# Altium project Qunyin_mmWave_core.PrjPcb (part 2 of 2)

## Sheet Qunyin_mmWave_flash&USB.SchDoc: mmWave_iwr6843aop
size 457 x 292 mm; DrawnBy: Wxd; Organization: Shanghai Qunyin; Address1: Xianxia Rd 601; Address2: Changning district; Address3: Shanghai; DocumentNumber: 4; SheetNumber: 4; SheetTotal: 6
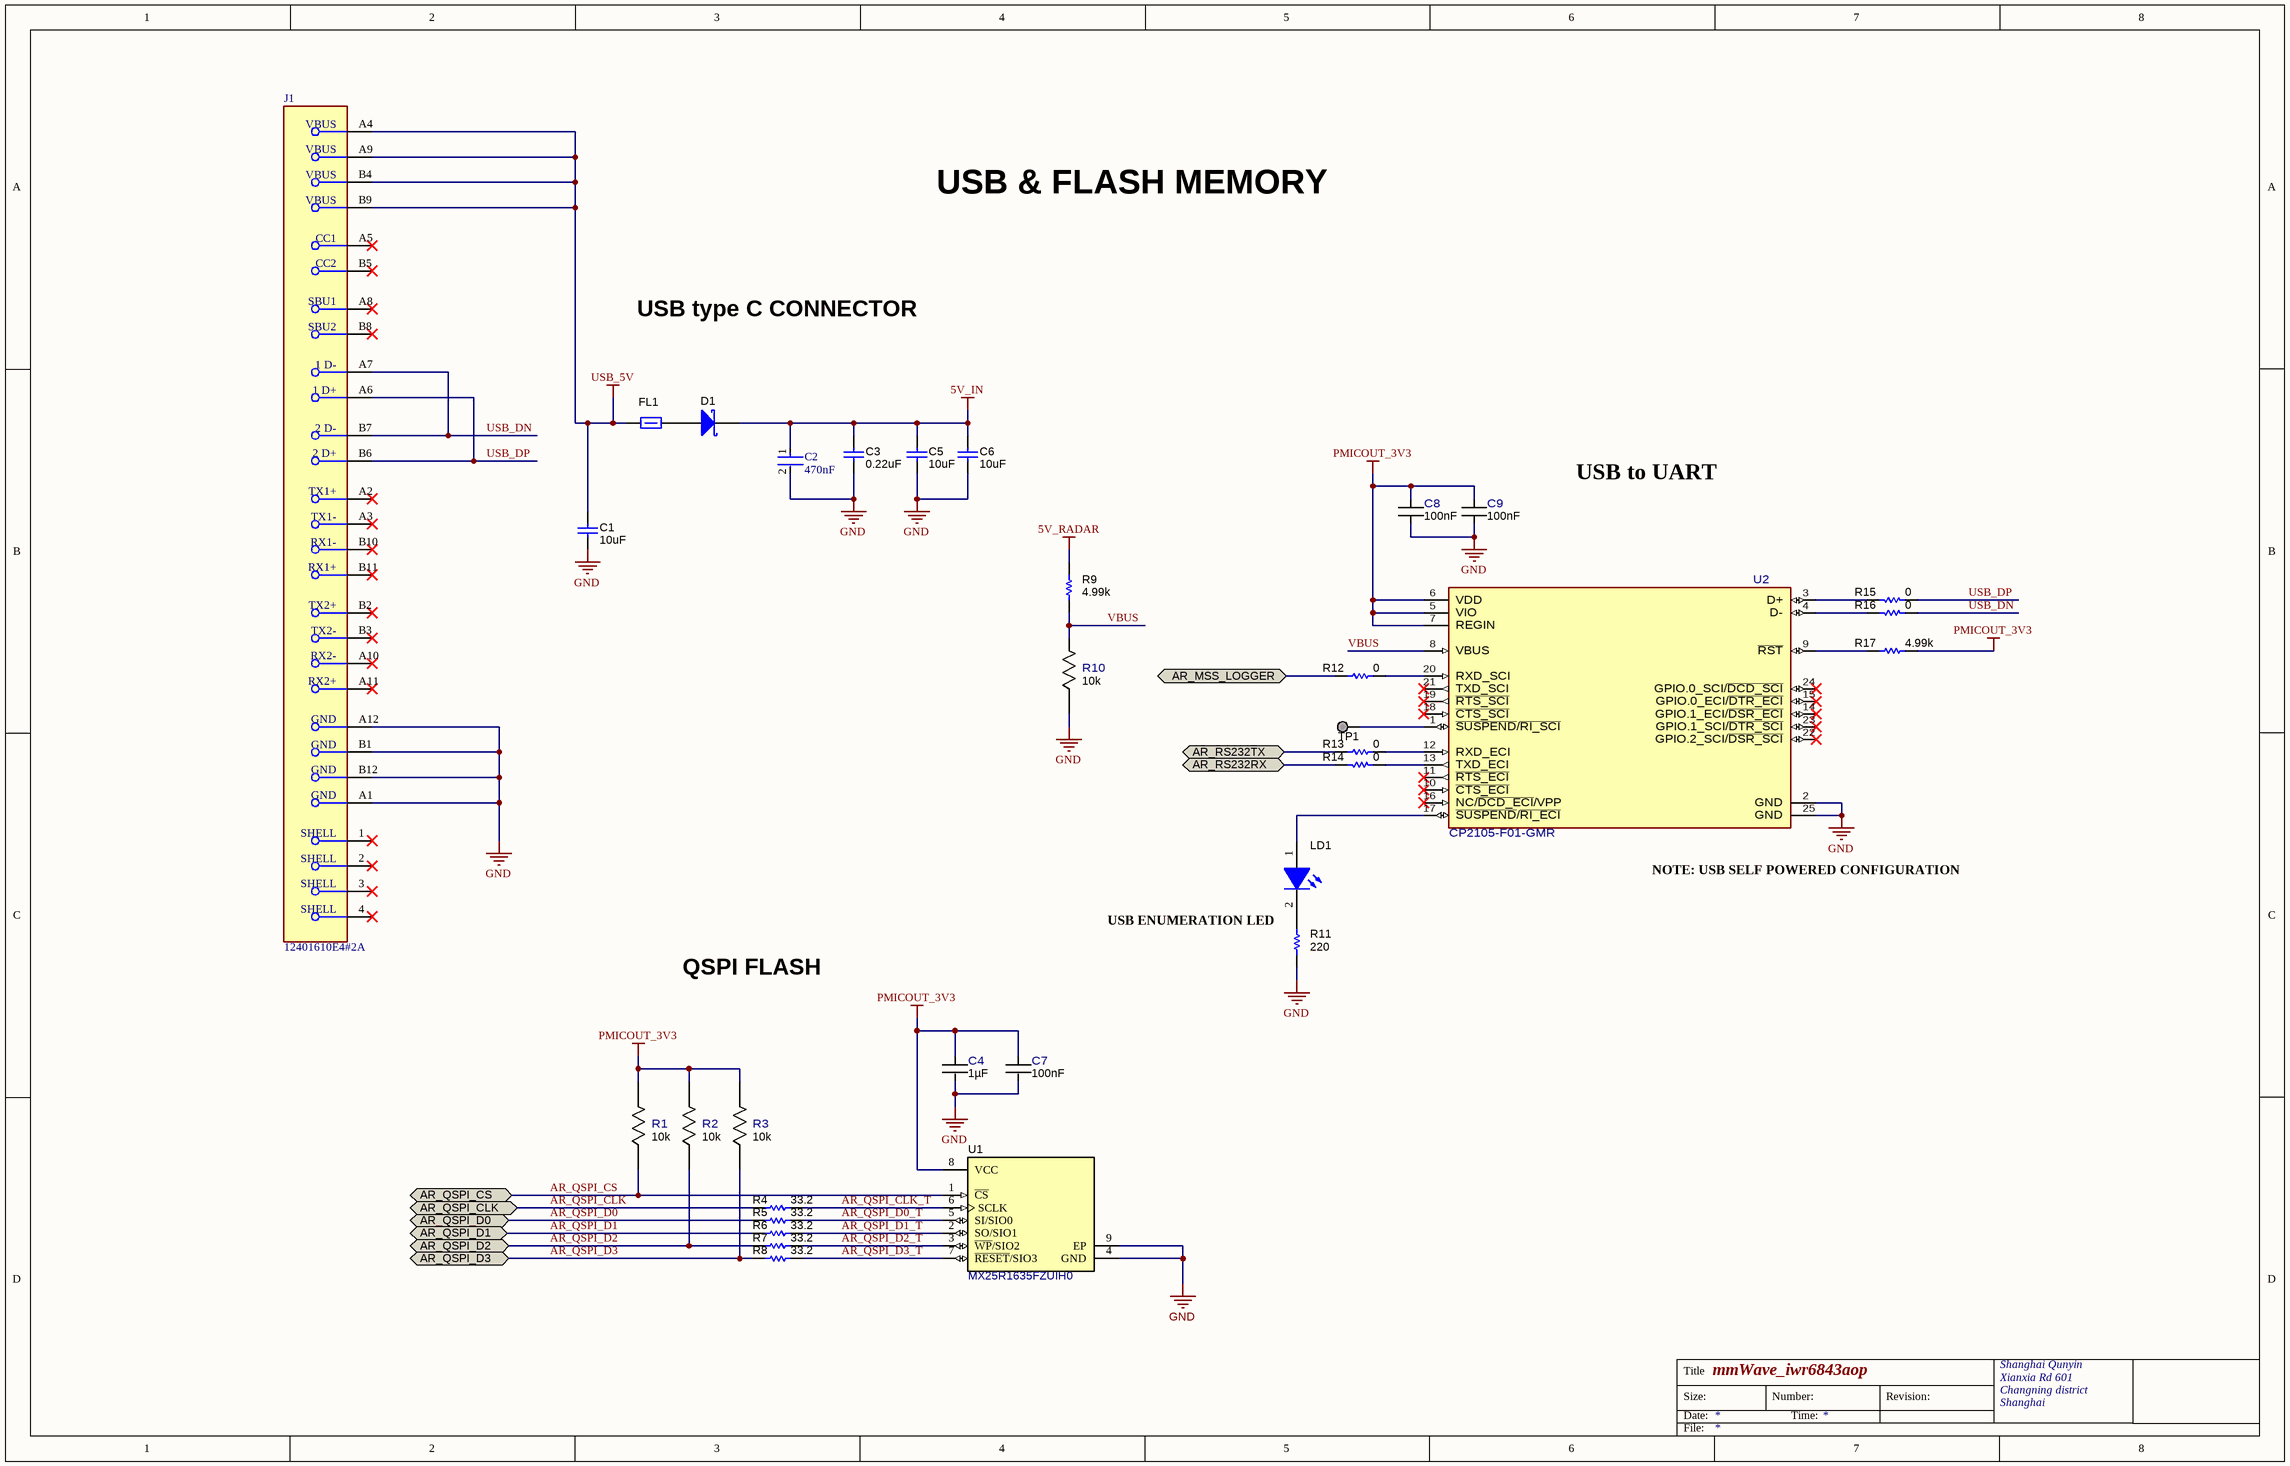
[diagram p3: Qunyin_mmWave_flash&USB.SchDoc]

### Parts
C1  value 10uF  [0402_070]  (hidden comment: CL05A106MP5NUNC)
C2  Capacitance: 470nF  [FP-C1005-050-0_05-IPC_B]  (hidden comment: C1005X5R1E474K050BB)
C3  value 0.22uF  [0201_033L]  (hidden comment: LMK063BJ224MP-F)
C4  Cap_F: 1µF  [FP-CL03A105MO3NRNH_0201-IPC_C]  (hidden comment: CL03A105MO3NRNH)
C5  value 10uF  [0402_070]  (hidden comment: CL05A106MP5NUNC)
C6  value 10uF  [0402_070]  (hidden comment: CL05A106MP5NUNC)
C7  Cap_F: 100nF  [FP-GRM033R6YA104KE14D_0201 (0603 Metric)-IPC_C]  (hidden comment: GRM033R6YA104KE14D)
C8  Cap_F: 100nF  [FP-GRM033R6YA104KE14D_0201 (0603 Metric)-IPC_C]  (hidden comment: GRM033R6YA104KE14D)
C9  Cap_F: 100nF  [FP-GRM033R6YA104KE14D_0201 (0603 Metric)-IPC_C]  (hidden comment: GRM033R6YA104KE14D)
D1  NSR20F30NXT5G  [DSN2_0603]  (value not drawn)
FL1  BLM15PD300SZ1D  [0402L]  (value not drawn)
J1  12401610E4#2A  [FP-12401610E4#2A-MFG]
LD1  APHHS1005CGCK  [APHHS1005_Green]  (value not drawn)
R1  Res_ohm: 10k  [FP-RR0306P-103-D_0201-IPC_C]  (hidden comment: RR0306P-103-D)
R2  Res_ohm: 10k  [FP-RR0306P-103-D_0201-IPC_C]  (hidden comment: RR0306P-103-D)
R3  Res_ohm: 10k  [FP-RR0306P-103-D_0201-IPC_C]  (hidden comment: RR0306P-103-D)
R4  value 33.2  [0201L]  (hidden comment: CRCW020133R2FNED)
R5  value 33.2  [0201L]  (hidden comment: CRCW020133R2FNED)
R6  value 33.2  [0201L]  (hidden comment: CRCW020133R2FNED)
R7  value 33.2  [0201L]  (hidden comment: CRCW020133R2FNED)
R8  value 33.2  [0201L]  (hidden comment: CRCW020133R2FNED)
R9  value 4.99k  [0201L]  (hidden comment: RC0201FR-074K99L)
R10  Res_ohm: 10k  [FP-RR0306P-103-D_0201-IPC_C]  (hidden comment: RR0306P-103-D)
R11  value 220  [0201L]  (hidden comment: RC0201JR-07220RL)
R12  Res_ohm: 0  [FP-RC0201JR-070RL_0201 (0603 Metric)-MFG]  (hidden comment: RC0201JR-070RL)
R13  Res_ohm: 0  [FP-RC0201JR-070RL_0201 (0603 Metric)-MFG]  (hidden comment: RC0201JR-070RL)
R14  Res_ohm: 0  [FP-RC0201JR-070RL_0201 (0603 Metric)-MFG]  (hidden comment: RC0201JR-070RL)
R15  Res_ohm: 0  [FP-RC0201JR-070RL_0201 (0603 Metric)-MFG]  (hidden comment: RC0201JR-070RL)
R16  Res_ohm: 0  [FP-RC0201JR-070RL_0201 (0603 Metric)-MFG]  (hidden comment: RC0201JR-070RL)
R17  value 4.99k  [0201L]  (hidden comment: RC0201FR-074K99L)
TP1  TESTPOINT  [TP_25MIL-SMT]  (value not drawn)  (no BOM)
U1  MX25R1635FZUIH0  [USON-8L]
U2  CP2105-F01-GMR  [FP-CP2105-F01-GMR_QFN24-EP-IPC_A]

### Ports
AR_MSS_LOGGER (bidir), AR_QSPI_CLK (bidir), AR_QSPI_CS (bidir), AR_QSPI_D0 (bidir), AR_QSPI_D1 (bidir), AR_QSPI_D2 (bidir), AR_QSPI_D3 (bidir), AR_RS232RX (bidir), AR_RS232TX (bidir)

### Nets
5V_IN: C2.1 C3.1 C5.2 C6.1 D1.1(K)
5V_RADAR: R9.1
GND: C1.1 C2.2 C3.2 C4.2 C5.1 C6.2 C7.2 C8.1 C9.1 J1.A1(GND) J1.A12(GND) J1.B1(GND) J1.B12(GND) R10.1 R11.1 U1.4(GND) U1.9(EP) U2.2(GND) U2.25(GND)  [project net AGND]
PMICOUT_3V3: C4.1 C7.1 C8.2 C9.2 R1.2 R2.2 R3.2 R17.1 U1.8(VCC) U2.5(VIO) U2.6(VDD) U2.7(REGIN)
USB_5V: C1.2 FL1.1 J1.A4(VBUS) J1.A9(VBUS) J1.B4(VBUS) J1.B9(VBUS)
AR_MSS_LOGGER: R12.2 ; port AR_MSS_LOGGER
AR_QSPI_CLK: R4.1 ; port AR_QSPI_CLK
AR_QSPI_CLK_T: R4.2 U1.6(SCLK)
AR_QSPI_CS: R1.1 U1.1(~{CS}) ; port AR_QSPI_CS
AR_QSPI_D0: R5.1 ; port AR_QSPI_D0
AR_QSPI_D0_T: R5.2 U1.5(SI/SIO0)
AR_QSPI_D1: R6.1 ; port AR_QSPI_D1
AR_QSPI_D1_T: R6.2 U1.2(SO/SIO1)
AR_QSPI_D2: R2.1 R7.1 ; port AR_QSPI_D2
AR_QSPI_D2_T: R7.2 U1.3(~{WP}/SIO2)
AR_QSPI_D3: R3.1 R8.1 ; port AR_QSPI_D3
AR_QSPI_D3_T: R8.2 U1.7(~{RESET}/SIO3)
AR_RS232RX: R14.1 ; port AR_RS232RX
AR_RS232TX: R13.2 ; port AR_RS232TX
USB_DN: J1.A7(1_D-) J1.B7(2_D-) R16.2
USB_DP: J1.A6(1_D+) J1.B6(2_D+) R15.2
VBUS: R9.2 R10.2 U2.8(VBUS)
NetD1_2: D1.2(A) FL1.2
NetLD1_1: LD1.1(A) U2.17(~{SUSPEND}/~{RI_ECI})
NetLD1_2: LD1.2(K) R11.2
NetR12_1: R12.1 U2.20(RXD_SCI)
NetR13_1: R13.1 U2.12(RXD_ECI)
NetR14_2: R14.2 U2.13(TXD_ECI)
NetR15_1: R15.1 U2.3(D+)
NetR16_1: R16.1 U2.4(D-)
NetR17_2: R17.2 U2.9(~{RST})
NetTP1_1: TP1.1 U2.1(~{SUSPEND}/~{RI_SCI})

Not connected (* = marked no-connect by the designer): J1 1(SHELL)* 2(SHELL)* 3(SHELL)* 4(SHELL)* A2(TX1+)* A3(TX1-)* A5(CC1)* A8(SBU1)* A10(RX2-)* A11(RX2+)* B2(TX2+)* B3(TX2-)* B5(CC2)* B8(SBU2)* B10(RX1-)* B11(RX1+)*; U2 10(~{CTS_ECI})* 11(~{RTS_ECI})* 14(GPIO.1_ECI/~{DSR_ECI})* 15(GPIO.0_ECI/~{DTR_ECI})* 16(NC/~{DCD_ECI}/VPP)* 18(~{CTS_SCI})* 19(~{RTS_SCI})* 21(TXD_SCI)* 22(GPIO.2_SCI/~{DSR_SCI})* 23(GPIO.1_SCI/~{DTR_SCI})* 24(GPIO.0_SCI/~{DCD_SCI})*

### Notes on the sheet
- USB & FLASH MEMORY
- USB type C CONNECTOR
- USB to UART
- (near U2) NOTE: USB SELF POWERED CONFIGURATION
- QSPI FLASH
- USB ENUMERATION LED
- Title
- Size:
- Date:
- Number:
- Time:
- Revision:
- File:

### Library data of the parts
C1 C5 C6 = CMP-0006339-4: CAP, CERM, 10 uF, 10 V, +/- 20%, X5R, 0402; Manufacturer: Samsung Electro-Mechanics; AEC Category: Q200; AEC Qualified: N; Cap_Case: 0402; Cap_F: 10µF; SizeArea_mm2: 0.5; SizeAreaWB_mm2: 3; SizeX_mm: 1; SizeZ_mm: 0.6; TaMax_C: 85°C; TaMin_C: -55°C; U/M: EA; Value1: Unknown; Value2: 10V; RoHS: Y; AEC Grade: N/A; ComponentLink1Description: Datasheet link; ComponentLink1URL: http://www.samsungsem.com/kr/support/product-search/mlcc/__icsFiles/afieldfile/2018/06/21/CL05A106MP5NUNC.pdf; CompType: Capacitor; MountType: SMT; PackageReference: 0402; PartNumber: CL05A106MP5NUNC; Polarized: N; SizeY_mm: 0.5; Technology: Ceramic; TempCo: X5R; Tolerance_%: 20%; ValueDisplayed: 10uF; VDC_V: 10V
C2 = CMP-2000-06003-2: Multilayer Ceramic Capacitors 470nF ±10% 25V X5R SMD 0402; Dissipation Factor: 10%; Case Code (Metric): 1005; RoHS Compliant: Yes; Lead Free: Lead Free; Length: 1mm; Case/Package: 0402; Termination: SMD/SMT; Voltage Rating: 25V; Dielectric Material: Ceramic; Dielectric: X5R; Depth: 0.5mm; Series: C; Voltage: 25V; Tolerance: 10%; Packaging: Tape and Reel; Resistor Type: Ceramic; Min Operating Temperature: -55°C; Width: 0.02inch; Thickness: 500um; Package Quantity: 10000; Case Code (Imperial): 0402; Construction: Flat; Height: 0.5mm; REACH SVHC: No SVHC; Radiation Hardening: No; Weight: 2.3E-05oz; Mount: Surface Mount; Voltage Rating (DC): 25V; Max Operating Temperature: 85°C
C3 = CMP-0009781-1: CAP, CERM, 0.22 uF, 10 V, +/- 20%, X5R, 0201; Manufacturer: Taiyo Yuden; AEC Category: Q200; AEC Qualified: N; Cap_Case: 0201; Cap_F: 220nF; SizeArea_mm2: 0.18; SizeAreaWB_mm2: 2.08; SizeX_mm: 0.6; SizeY_mm: 0.3; SizeZ_mm: 0.33; TaMax_C: 85°C; TaMin_C: -55°C; U/M: EA; Value1: Unknown; Value2: 10V; RoHS: Y; AEC Grade: N/A; ComponentLink1Description: Datasheet link; ComponentLink1URL: http://www.yuden.co.jp/productdata/catalog/en/mlcc_all_e.pdf; CompType: Capacitor; LatestRevisionDate: 2017-03-09; MountType: SMT; PackageReference: 0201; PartNumber: LMK063BJ224MP-F; Polarized: N; Published: 2008-06-19; Publisher: Texas Instruments; Supplier 1: Digi-Key; Supplier 2: Newark; Supplier 3: Mouser; Supplier Part Number 1: 587-2483-1-ND; Supplier Part Number 2: 48T3327; Supplier Part Number 3: 963-LMK063BJ224MP-F; Technology: Ceramic; TempCo: X5R; Tolerance_%: 20%; ValueDisplayed: 0.22uF; VDC_V: 10V
C4 = CMP-0086446-1: 1µF ±20% 16V Ceramic Capacitor X5R 0201; Manufacturer: Samsung Electro-Mechanics; AEC Qualified: No; SizeZ_mm: 0.39mm; Symbol Name: SYM-CL03A105MO3NRNH; TempCo: 15%; RoHS: TRUE; ComponentLink1Description: Datasheet; ComponentLink1URL: http://www.samsungsem.com/global/front/downloadcms.do?path=%2F%2Fglobal%2F%2Fsupport%2F%2Fproduct-search%2F%2Fmlcc%2F%2F__icsFiles%2F%2Fafieldfile%2F%2F2018%2F%2F06%2F%2F21&fileName=CL03A105MO3NRNH.pdf; PackageReference: 0201; PartNumber: CL03A105MO3NRNH; Tolerance_%: 20%; VDC_V: 16V
C7-C9 = CMP-0086440-1: Cap Ceramic 0.1uF 35V X5R 10% Pad SMD 0201 85C T/R; Manufacturer: Murata Electronics North America; AEC Qualified: No; SizeZ_mm: 0.33mm; Symbol Name: SYM-GRM033R6YA104KE14D; TempCo: 15%; RoHS: TRUE; ComponentLink1Description: Datasheet; ComponentLink1URL: https://search.murata.co.jp/Ceramy/image/img/A01X/G101/ENG/GRM033R6YA104KE14-01.pdf; PackageReference: 0201 (0603 Metric); PartNumber: GRM033R6YA104KE14D; Tolerance_%: 10%; VDC_V: 35V
D1 = CMP-0028829-2: Diode, Schottky, 30 V, 2 A, 2-XFDFN; Manufacturer: ON Semiconductor; Value2: 0.48V; SizeY_mm: 0.8; Value: 30V; TJmax_C: 150°C; Green_Lifecycle: Not Set; SizeAreaWB_mm2: 4.68; Value1: 2A; SizeArea_mm2: 1.28; Green_REACh: Incomplete; AEC Category: Q101; SizeZ_mm: 0.31; Vf_V: 480mV; AEC Qualified: N; SizeX_mm: 1.6; Green_EU RoHS: Incomplete; PackageReference: 2-XFDFN; RoHS: Y; PartNumber: NSR20F30NXT5G; ComponentLink1Description: Datasheet link; Vr_V: 30V; MountType: SMT; Type: Schottky; CompType: Diode; Green_EU RoHS-2: Incomplete; ComponentLink1URL: http://www.onsemi.com/pub_link/Collateral/NSR20F30-D.PDF; Io_A: 2A
FL1 = CMP-0078934-1: Inductor, Ferrite Bead, Ferrite, 2.2 A, 0.035 ohm, AEC-Q200 Grade 1, SMD; Manufacturer: MuRata; AEC Category: Q200; AEC Grade: 1; AEC Qualified: Y; DCR_ohm: 0.035; Imax_A: 2.2A; SizeArea_mm2: 0.5; SizeAreaWB_mm2: 3; SizeZ_mm: 0.6; RoHS: Y; ComponentLink1Description: Datasheet link; ComponentLink1URL: https://www.murata.com/en-us/products/productdata/8796748677150/QNFA9118.pdf; CompType: Inductor; LatestRevisionDate: 2017-12-07; Material: Ferrite; MountType: SMT; PackageReference: 0402; PartNumber: BLM15PD300SZ1D; Published: 2008-06-26; Publisher: Texas Instruments; SizeX_mm: 1; SizeY_mm: 0.5; Supplier 1: Digi-Key; Supplier 2: Mouser; Supplier Part Number 1: 490-16506-1-ND; Supplier Part Number 2: 81-BLM15PD300SZ1D; Technology: Ferrite Bead; Value1: 0.035 ohm; Value2: 2.2A
J1 = CMP-02355-000003-1: CONN RCP USB3.1 TYPEC 24P SMD RA; Connector Type: USB; Number of Contacts: 24; Gender: Receptacle; Packaging: Cut Tape; Mount: Surface Mount; Number of Pins: 24
LD1 = CMP-0067682-2: LED, Green, SMD; Manufacturer: Kingbright; Angle: 120.0; Power_TotalModule: 75mW; SizeZ_mm: 0.6; Vf_V: 2.1V; Vr_V: 5V; Io_A: 20mA; Ir_A: 10µA; SizeArea_mm2: 0.5; SizeAreaWB_mm2: 3.0; SizeX_mm: 1.0; Tjmax_C: 85°C; Value1: 0.075W; RoHS: Y; Color: Green; ComponentLink1Description: Datasheet link; ComponentLink1URL: http://www.kingbrightusa.com/images/catalog/SPEC/APHHS1005CGCK.pdf; PackageReference: 0402; PartNumber: APHHS1005CGCK; CompType: LED; MountType: SMT; SizeY_mm: 0.5; Type: ?; Value2: 2.1V; Value: Green
R1-R3 R10 = CMP-0088002-1: 10 kOhms ±0.5% 0.05W, 1/20W Chip Resistor 0201 (0603 Metric)  Thin Film; Manufacturer: Susumu; AEC Qualified: No; Power_W: 50mW; SizeZ_mm: 0.26mm; Symbol Name: SYM-RR0306P-103-D; TempCo: 25ppm/°C; VDC_V: 15V; RoHS: TRUE; ComponentLink1Description: Datasheet; ComponentLink1URL: https://www.susumu.co.jp/common/pdf/n_catalog_partition05_en.pdf; PackageReference: 0201; PartNumber: RR0306P-103-D; Technology: Thin Film; Tolerance_%: 0.5%
R4-R8 = CMP-0027275-3: RES, 33.2, 1%, 0.05 W, 0201; Manufacturer: Vishay-Dale; AEC Category: Q200; AEC Qualified: N; EIA_Code: E96; Power_W: 50mW; SizeArea_mm2: 0.18; SizeX_mm: 0.6; SizeY_mm: 0.3; SizeZ_mm: 0.26; TempCo: 200 ppm/C; Value2: 0.05W; Value_Code: 33R2; RoHS: E; AEC Grade: N/A; ComponentLink1Description: Datasheet link; ComponentLink1URL: http://www.vishay.com/docs/20052/crcw0201e3.pdf; CompType: Resistor; MountType: SMT; PackageReference: 0201; PartNumber: CRCW020133R2FNED; Res_ohm: 33.2; Supplier 1: Digi-Key; Supplier 2: Newark; Supplier 3: Mouser; Supplier Part Number 1: 541-33.2ABCT-ND; Supplier Part Number 2: 26W8649; Supplier Part Number 3: 71-CRCW020133R2FNED; Technology: Thick Film; Tolerance_%: 1%; Value1: 1%; ValueDisplayed: 33.2
R9 R17 = CMP-0027745-1: RES, 4.99 k, 1%, 0.05 W, 0201; Manufacturer: Yageo America; AEC Category: Q200; AEC Qualified: N; EIA_Code: E96; Power_W: 50mW; SizeArea_mm2: 0.18; SizeX_mm: 0.6; SizeY_mm: 0.3; SizeZ_mm: 0.26; TempCo: 200 ppm/C; U/M: EA; Value2: 0.05W; Value_Code: 4k99; VDC_V: 25V; RoHS: Y; AEC Grade: N/A; ComponentLink1Description: Datasheet link; ComponentLink1URL: http://www.yageo.com/documents/recent/PYu-RC_Group_51_RoHS_L_5.pdf; CompType: Resistor; LatestRevisionDate: 2017-03-09; MountType: SMT; PackageReference: 0201; PartNumber: RC0201FR-074K99L; Published: 2016-10-14; Publisher: Texas Instruments; Res_ohm: 4.99k; Supplier 1: Digi-Key; Supplier 2: Mouser; Supplier Part Number 1: YAG2712CT-ND; Supplier Part Number 2: 603-RC0201FR-074K99L; Technology: Thick Film; Tolerance_%: 1%; Value1: 1%; ValueDisplayed: 4.99k
R11 = CMP-0027072-1: RES, 220, 5%, 0.05 W, 0201; Manufacturer: Yageo America; AEC Category: Q200; AEC Qualified: N; EIA_Code: E24; Power_W: 50mW; SizeArea_mm2: 0.18; SizeX_mm: 0.6; SizeY_mm: 0.3; SizeZ_mm: 0.26; TempCo: 200 ppm/C; U/M: EA; Value2: 0.05W; Value_Code: 220R; VDC_V: 25V; RoHS: Y; AEC Grade: N/A; ComponentLink1Description: Datasheet link; ComponentLink1URL: http://www.yageo.com/documents/recent/PYu-RC_Group_51_RoHS_L_5.pdf; CompType: Resistor; LatestRevisionDate: 2017-03-09; MountType: SMT; PackageReference: 0201; PartNumber: RC0201JR-07220RL; Published: 2016-10-14; Publisher: Texas Instruments; Res_ohm: 220; Supplier 1: Digi-Key; Supplier 2: Mouser; Supplier Part Number 1: 311-220NCT-ND; Supplier Part Number 2: 603-RC0201JR-07220RL; Technology: Thick Film; Tolerance_%: 5%; Value1: 5%; ValueDisplayed: 220
R12-R16 = CMP-0086442-2: RES SMD 0 OHM JUMPER 1/20W 0201; Manufacturer: Yageo; AEC Qualified: No; Power_W: 50mW; SizeZ_mm: 0.26mm; TempCo: 200ppm/°C; Tolerance_%: 5%; VDC_V: 25V; RoHS: TRUE; ComponentLink1Description: Datasheet; ComponentLink1URL: http://www.yageo.com/documents/recent/PYu-RC_Group_51_RoHS_L_10.pdf; PackageReference: 0201 (0603 Metric); PartNumber: RC0201JR-070RL; Technology: Thick Film
TP1 = CMP-0078143-3: TEST POINT.  No entry in BOM.; CompType: Testpoint; Manufacturer: N/A; PackageReference: N/A; PartNumber: N/A; Library Reference: TESTPOINT
U1 = CMP-0078466-1: ULTRA LOW POWER, 16M-BIT [x 1/x 2/x 4] CMOS MXSMIO (SERIAL MULTI I/O) FLASH MEMORY, SON-8; Manufacturer: Macronix International Co., LTD; SizeArea_mm2: 6; SizeAreaWB_mm2: 12; SizeX_mm: 3; SizeY_mm: 2; SizeZ_mm: 0.6; RoHS: Y; ComponentLink1Description: Datasheet URL; ComponentLink1URL: http://www.macronix.com/Lists/Datasheet/Attachments/6257/MX25R1635F,%20Wide%20Range,%2016Mb,%20v1.5.pdf; MountType: SMT; PackageReference: SON-8; PartNumber: MX25R1635FZUIH0; Supplier 1: Digi-Key; Supplier Part Number 1: 1092-1178-1-ND
U2 = CMP-0087172-1: I/O Controller Interface IC USB to Dual UART bridge; Manufacturer: Silicon Labs; SizeZ_mm: 0.8mm; RoHS: TRUE; ComponentLink1Description: Datasheet; ComponentLink1URL: https://www.silabs.com/documents/public/data-sheets/CP2105.pdf; PackageReference: QFN24-EP; PartNumber: CP2105-F01-GMR; Symbol Name: SYM-CP2105-F01-GMR

## Sheet Qunyin_mmWave_ESP32.SchDoc: mmWave_iwr6843aop
size 457 x 292 mm; DrawnBy: Wxd; Organization: Shanghai Qunyin; Address1: Xianxia Rd 601; Address2: Changning district; Address3: Shanghai; DocumentNumber: 5; SheetNumber: 5; SheetTotal: 6
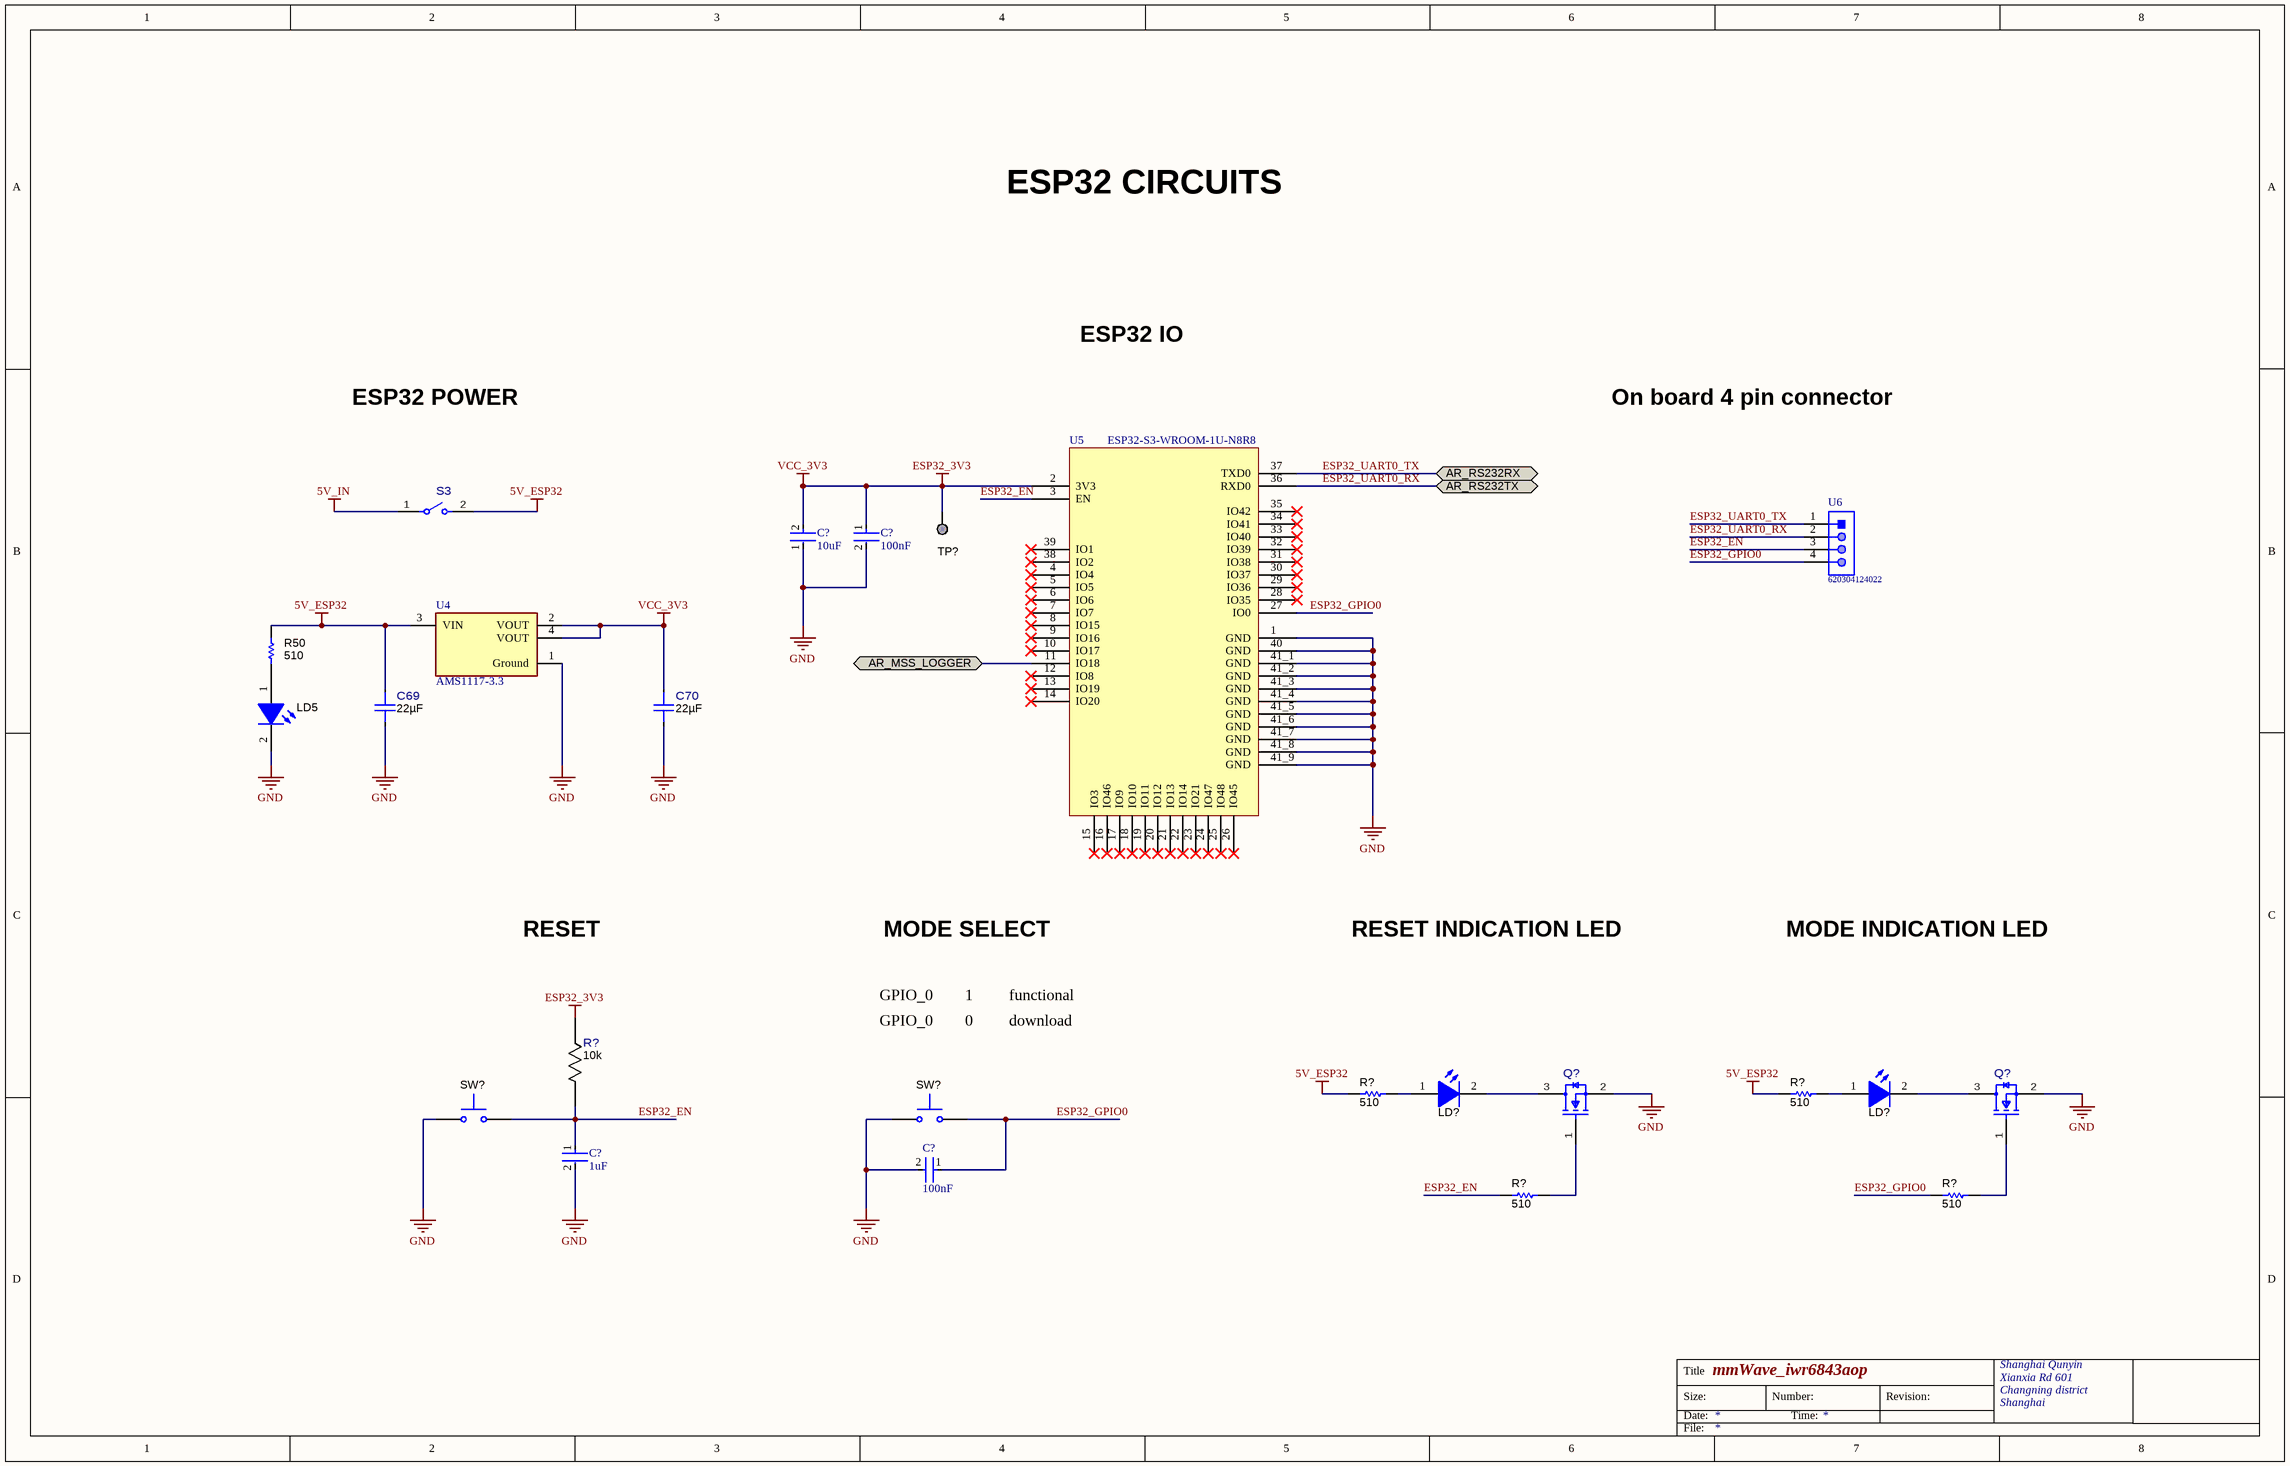
[diagram p4: Qunyin_mmWave_ESP32.SchDoc]

### Parts
(Parts that share a designator on the sheet are numbered #1, #2 ... from top to bottom, then left to right.)
C69  Cap_F: 22µF  [FP-CL05A226MQ5N6J8_0402-IPC_C]  (hidden comment: CL05A226MQ5N6J8)
C70  Cap_F: 22µF  [FP-CL05A226MQ5N6J8_0402-IPC_C]  (hidden comment: CL05A226MQ5N6J8)
C?#1  Capacitance: 10uF  [FP-C1608-080-0_1-MFG]  (hidden comment: C1608X5R1A106K080AC)
C?#2  Capacitance: 100nF  [FP-C1005-050-0_05-IPC_C]  (hidden comment: C1005X7R1H104K050BB)
C?#3  Capacitance: 1uF  [FP-0603-L_1_6_0_1-W_0_8_0-IPC_A]  (hidden comment: TMK107B7105KA-T)
C?#4  Capacitance: 100nF  [FP-C1005-050-0_05-IPC_C]  (hidden comment: C1005X7R1H104K050BB)
LD5  APHHS1005CGCK  [APHHS1005_Green]  (value not drawn)
LD?#1  APHHS1005CGCK  [APHHS1005_Green]  (value not drawn)
LD?#2  APHHS1005CGCK  [APHHS1005_Green]  (value not drawn)
Q?#1  BSS123-7-F  [FP-BSS123-7-F_SOT23-IPC_C]  (value not drawn)
Q?#2  BSS123-7-F  [FP-BSS123-7-F_SOT23-IPC_C]  (value not drawn)
R50  value 510  [0201L]  (hidden comment: RC0201JR-07510RL)
R?#1  Res_ohm: 10k  [FP-RR0306P-103-D_0201-IPC_C]  (hidden comment: RR0306P-103-D)
R?#2  value 510  [0201L]  (hidden comment: RC0201JR-07510RL)
R?#3  value 510  [0201L]  (hidden comment: RC0201JR-07510RL)
R?#4  value 510  [0201L]  (hidden comment: RC0201JR-07510RL)
R?#5  value 510  [0201L]  (hidden comment: RC0201JR-07510RL)
S3  CHS-01TA  [FP-CHS-01TA_SMT_SW_5MM4_2MM5-MFG]  (value not drawn)
SW?#1  B3U-1000P  [SW_B3U-1000P]  (value not drawn)
SW?#2  B3U-1000P  [SW_B3U-1000P]  (value not drawn)
TP?  TESTPOINT  [TP_25MIL-SMT]  (value not drawn)  (no BOM)
U4  AMS1117-3.3  [FP-AMS1117-IPC_C]
U5  ESP32-S3-WROOM-1U-N8R8  [XCVR_ESP32-S3-WROOM-1U]
U6  620304124022  [620304124022]

### Ports
AR_MSS_LOGGER (bidir), AR_RS232RX (bidir), AR_RS232TX (bidir)

### Nets
5V_ESP32: C69.1 R50.1 R?#2.1 R?#3.1 S3.2 U4.3(VIN)
5V_IN: S3.1
ESP32_3V3: C70.1 C?#1.2 C?#2.1 R?#1.1 TP?.1 U4.2(VOUT) U4.4(VOUT) U5.2(3V3)  [also labelled VCC_3V3]
GND: C69.2 C70.2 C?#1.1 C?#2.2 C?#3.2 C?#4.2 LD5.2(K) Q?#1.2(S) Q?#2.2(S) SW?#1.2 SW?#2.2 U4.1(Ground) U5.1(GND) U5.40(GND) U5.41_1(GND) U5.41_2(GND) U5.41_3(GND) U5.41_4(GND) U5.41_5(GND) U5.41_6(GND) U5.41_7(GND) U5.41_8(GND) U5.41_9(GND)  [project net AGND]
AR_MSS_LOGGER: U5.11(IO18) ; port AR_MSS_LOGGER
ESP32_EN: C?#3.1 R?#1.2 R?#4.1 SW?#1.1 U5.3(EN) U6.3
ESP32_GPIO0: C?#4.1 R?#5.1 SW?#2.1 U5.27(IO0) U6.4
ESP32_UART0_RX: U5.36(RXD0) U6.2 ; port AR_RS232TX  [project net AR_RS232TX]
ESP32_UART0_TX: U5.37(TXD0) U6.1 ; port AR_RS232RX  [project net AR_RS232RX]
NetLD5_1: LD5.1(A) R50.2
NetLD?#1_1: LD?#1.1(A) R?#2.2
NetLD?#1_2: LD?#1.2(K) Q?#1.3(D)
NetLD?#2_1: LD?#2.1(A) R?#3.2
NetLD?#2_2: LD?#2.2(K) Q?#2.3(D)
NetQ?#1_1: Q?#1.1(G) R?#4.2
NetQ?#2_1: Q?#2.1(G) R?#5.2

Not connected (* = marked no-connect by the designer): U5 4(IO4)* 5(IO5)* 6(IO6)* 7(IO7)* 8(IO15)* 9(IO16)* 10(IO17)* 12(IO8)* 13(IO19)* 14(IO20)* 15(IO3)* 16(IO46)* 17(IO9)* 18(IO10)* 19(IO11)* 20(IO12)* 21(IO13)* 22(IO14)* 23(IO21)* 24(IO47)* 25(IO48)* 26(IO45)* 28(IO35)* 29(IO36)* 30(IO37)* 31(IO38)* 32(IO39)* 33(IO40)* 34(IO41)* 35(IO42)* 38(IO2)* 39(IO1)*

### Notes on the sheet
- ESP32 CIRCUITS
- ESP32 IO
- ESP32 POWER
- On board 4 pin connector
- RESET
- MODE SELECT
- RESET INDICATION LED
- MODE INDICATION LED
- GPIO_0        1         functional
- GPIO_0        0         download
- Title
- Size:
- Date:
- Number:
- Time:
- Revision:
- File:

### Library data of the parts
C69 C70 = CMP-0089043-3: CAP CER 22UF 6.3V X5R 0402; Manufacturer: Samsung Electro-Mechanics; TempCo: 15%; AEC Qualified: No; Tolerance_%: 20%; SizeZ_mm: 0.55mm; ComponentLink1URL: http://www.samsungsem.com/kr/support/library/product-catalog/__icsFiles/afieldfile/2018/11/28/MLCC.pdf; RoHS: TRUE; PartNumber: CL05A226MQ5N6J8; ComponentLink1Description: Datasheet; PackageReference: 0402; VDC_V: 6.3V; ValueDisplayed: 22uF; Part Number: CL05A226MQ5N6J8
C?#1 = CMP-2000-04979-3: Multilayer Ceramic Capacitors 10μF ±10% 10V X5R SMD 0603; Dielectric Material: Ceramic; Construction: Flat; Height: 0.8mm; Thickness: 0.035inch; Case Code (Metric): 1608; Radiation Hardening: No; Number of Pins: 2; Voltage Rating (DC): 10V; Depth: 0.8mm; Voltage: 10V; RoHS Compliant: Yes; Voltage Rating: 10V; Package Quantity: 1; Resistor Type: Ceramic; Termination: SMD/SMT; Lead Free: Lead Free; REACH SVHC: No SVHC; Tolerance: 10%; Mount: Surface Mount; Series: C; Packaging: Tape and Reel; Width: 0.8mm; Dielectric: X5R; Weight: 7.1E-05oz; Length: 1.6mm; Max Operating Temperature: 85°C; Case Code (Imperial): 0603; Case/Package: 0603; Min Operating Temperature: -55°C
C?#2 C?#4 = CMP-2000-05393-2: Multilayer Ceramic Capacitors 100nF ±10% 50V X7R SMD 0402; Voltage: 50V; Dielectric Material: Ceramic; Min Operating Temperature: -55°C; Depth: 0.5mm; Radiation Hardening: No; RoHS Compliant: Yes; Voltage Rating (DC): 50V; Lead Free: Lead Free; Resistor Type: Ceramic; Height: 0.5mm; Dielectric: X7R; Thickness: 0.022inch; Case/Package: 0402; Case Code (Metric): 1005; Termination: SMD/SMT; Packaging: Tape and Reel; Max Operating Temperature: 125°C; Mount: Surface Mount; Package Quantity: 1; Width: 0.02inch; Weight: 2.3E-05oz; Voltage Rating: 50V; Tolerance: 10%; Construction: Flat; Case Code (Imperial): 0402; Length: 1mm; REACH SVHC: No SVHC; Series: C
C?#3 = CMP-2000-07259-3: None; Voltage Rating (DC): 25V; Dielectric: X7R; Tolerance: 10%; Height: 0.8mm; Case Code (Metric): 1608; Max Operating Temperature: 125°C; Case Code (Imperial): 0603; Case/Package: 0603; Resistor Type: Ceramic; Halogen Free: Halogen Free; Series: M; Voltage Rating: 25V; Number of Pins: 2; Depth: 0.8mm; RoHS Compliant: Yes; Mount: Surface Mount; Min Operating Temperature: -55°C; Length: 1.6mm; Contact Plating: Tin; Radiation Hardening: No; Width: 0.031inch; Construction: Flat; Thickness: 0.035inch; Packaging: Tape and Reel; Termination: SMD/SMT; REACH SVHC: No SVHC; Package Quantity: 1
LD5 LD?#1 LD?#2 = CMP-0067682-2: as LD1 on sheet Qunyin_mmWave_flash&USB; RoHS: Y; Color: Green; ComponentLink1Description: Datasheet link; ComponentLink1URL: http://www.kingbrightusa.com/images/catalog/SPEC/APHHS1005CGCK.pdf; PackageReference: 0402; PartNumber: APHHS1005CGCK; CompType: LED; MountType: SMT; SizeY_mm: 0.5; Type: ?; Value2: 2.1V; Value: Green
Q?#1 Q?#2 = CMP-0087176-1: MOSFET N-CH 100V 170MA SOT23-3; Manufacturer: Diodes Incorporated; AEC Qualified: No; ChMode: False; Rdson45_ohm: 6; SizeZ_mm: 1.1mm; Vgs_V: 20V; RoHS: TRUE; ComponentLink1Description: Datasheet; ComponentLink1URL: https://www.diodes.com/assets/Datasheets/ds30366.pdf; IdsMax_A: 170mA; PackageReference: SOT23; PartNumber: BSS123-7-F; Symbol Name: SYM-BSS123-7-F; VdsMax_V: 100V
R50 R?#2-R?#5 = CMP-0027137-1: RES, 510, 5%, 0.05 W, 0201; Manufacturer: Yageo America; AEC Category: Q200; AEC Qualified: N; EIA_Code: E24; Power_W: 50mW; SizeArea_mm2: 0.18; SizeX_mm: 0.6; SizeY_mm: 0.3; SizeZ_mm: 0.26; TempCo: 200 ppm/C; U/M: EA; Value2: 0.05W; Value_Code: 510R; VDC_V: 25V; RoHS: Y; AEC Grade: N/A; ComponentLink1Description: Datasheet link; ComponentLink1URL: http://www.yageo.com/documents/recent/PYu-RC_Group_51_RoHS_L_5.pdf; CompType: Resistor; LatestRevisionDate: 2017-03-09; MountType: SMT; PackageReference: 0201; PartNumber: RC0201JR-07510RL; Published: 2016-10-14; Publisher: Texas Instruments; Res_ohm: 510; Supplier 1: Digi-Key; Supplier 2: Mouser; Supplier Part Number 1: YAG2907CT-ND; Supplier Part Number 2: 603-RC0201JR-07510RL; Technology: Thick Film; Tolerance_%: 5%; Value1: 5%; ValueDisplayed: 510
R?#1 = CMP-0088002-1: as R1 on sheet Qunyin_mmWave_flash&USB; RoHS: TRUE; ComponentLink1Description: Datasheet; ComponentLink1URL: https://www.susumu.co.jp/common/pdf/n_catalog_partition05_en.pdf; PackageReference: 0201; PartNumber: RR0306P-103-D; Technology: Thin Film; Tolerance_%: 0.5%
S3 = CMP-0087181-1: SWITCH SLIDE DIP SPST 100MA 6V; Manufacturer: Nidec Copal Electronics; PositionCount: 1; SizeZ_mm: 2.5mm; Symbol Name: SYM-CHS-01TA; RoHS: TRUE; Circuit: SPST; ComponentLink1Description: Datasheet; ComponentLink1URL: https://www.nidec-copal-electronics.com/e/catalog/switch/chs.pdf; MountType: Surface Mount; PackageReference: SMT_SW_5MM4_2MM5; PartNumber: CHS-01TA; VDC_V: 6V
SW?#1 SW?#2 = CMP-0002150-2: SWITCH TACTILE SPST-NO 0.05A 12V; Manufacturer: Omron Electronic Components; CurrentRating_mA: 50A; PositionCount: 1; SwitchFunction: Off-Mom; RoHS: Y; Circuit: SPST-NO; ComponentLink1Description: Datasheet URL; ComponentLink1URL: http://www.components.omron.com/components/web/PDFLIB.nsf/0/2DD3893C7DD33E9E862572900079E9D6/$file/B3U_1110.pdf; CompType: Switch; LatestRevisionDate: 2017-03-09; MountType: SMT; Orientation: Top Actuated; PackageReference: 3x1.6x2.5mm; PartNumber: B3U-1000P; Publisher: Texas Instruments; Supplier 1: Digi-Key; Supplier 2: Newark; Supplier 3: Mouser; Supplier Part Number 1: SW1020CT-ND; Supplier Part Number 2: 34M5295; Supplier Part Number 3: 653-B3U-1000P; VDC_V: 12V
TP? = CMP-0078143-3: TEST POINT.  No entry in BOM.; CompType: Testpoint; Manufacturer: N/A; PackageReference: N/A; PartNumber: N/A; Library Reference: TESTPOINT
U4 = CMP-209535-000001-1: LDO Voltage Regulators 1A, 3.3V; Manufacturer: Advanced Monolithic Systems; Dropout Voltage: 1.1V; Output Type: Fixed; Nominal Supply Current: 5mA; Max Power Dissipation: 1.2W; Max Supply Voltage: 15V; Number Of Outputs: 1; Standoff Height: 0.64mm; Max Junction Temp: +125°C; Height: 1.8mm; Package: AMS1117; Device Class L2: Power Management ICs; ComponentLink2Description: Datasheet; ComponentLink2URL: http://www.advanced-monolithic.com/pdf/ds1117.pdf; Category: IC; RoHS: TRUE; Automotive: No; Device Class L1: Integrated Circuits (ICs); Output Current: 1A; Device Class L3: Voltage Regulators - Linear; Temperature: -40°C to +125°C; Output Voltage: 3.3V; Manufacturer Part Number: AMS1117-3.3; Temperature Range Low: -40°C; Octopart: https://octopart.com/ams1117-3.3-advanced+monolithic+systems-25899300; Lead Free: Yes; Ipc Land Pattern Name: SOT229P700X180-4; Temperature Range High: +125°C
U6 = CMP-1502-00662-1: Male Shrouded Header WR-WTB, SMT, Vertical, pitch 2 mm, 1 x 4 position; Manufacturer: Wurth Elektronik; Working Voltage: 100VAC; Contact Resistance: 20mOhm; Pitch: 2mm; Position: 1x4; Part Number: 620304124022; Orientation: Vertical; Publisher: WurthElektronik; Packaging: TapeandReel; Gender: Male; Mounting Technology: SMT; Operating Temperature: -25to85degC; Manufacturer URL: http://www.we-online.de; Package Reference: 620304124022; Datasheet URL: https://katalog.we-online.de/em/datasheet/6203xx124022.pdf

## Nets that join several sheets
5V_IN: Qunyin_mmWave_pmic (S1.1), Qunyin_mmWave_flash&USB (5 pins), Qunyin_mmWave_ESP32 (S3.1)
5V_RADAR: Qunyin_mmWave_mainIOs (R40.1), Qunyin_mmWave_pmic (15 pins), Qunyin_mmWave_flash&USB (R9.1)
AGND: Qunyin_mmWave_mainIOs (14 pins), Qunyin_mmWave_mainPowers (114 pins), Qunyin_mmWave_pmic (27 pins), Qunyin_mmWave_flash&USB (19 pins), Qunyin_mmWave_ESP32 (23 pins)
AR_1P0_RF1: Qunyin_mmWave_mainPowers (7 pins), Qunyin_mmWave_pmic (L8.2)
AR_1P0_RF2: Qunyin_mmWave_mainPowers (7 pins), Qunyin_mmWave_pmic (FL5.1 L6.2)
AR_1P2: Qunyin_mmWave_mainPowers (FL2.1), Qunyin_mmWave_pmic (L7.2)
AR_VOUT_PA: Qunyin_mmWave_mainPowers (7 pins), Qunyin_mmWave_pmic (FL5.2)
BB_1V8: Qunyin_mmWave_mainPowers (7 pins), Qunyin_mmWave_pmic (FL6.2)
PMICOUT_3V3: Qunyin_mmWave_mainIOs (12 pins), Qunyin_mmWave_mainPowers (5 pins), Qunyin_mmWave_pmic (FL4.2), Qunyin_mmWave_flash&USB (12 pins)
VCLK_1V8: Qunyin_mmWave_mainPowers (7 pins), Qunyin_mmWave_pmic (FL7.2)
VIOIN_1V8: Qunyin_mmWave_mainPowers (8 pins), Qunyin_mmWave_pmic (FL8.2)
AR_MSS_LOGGER: Qunyin_mmWave_mainIOs (U3.E2), Qunyin_mmWave_flash&USB (R12.2), Qunyin_mmWave_ESP32 (U5.11)
AR_QSPI_CLK: Qunyin_mmWave_mainIOs (U3.H2), Qunyin_mmWave_flash&USB (R4.1)
AR_QSPI_CS: Qunyin_mmWave_mainIOs (U3.J2), Qunyin_mmWave_flash&USB (R1.1 U1.1)
AR_QSPI_D0: Qunyin_mmWave_mainIOs (U3.H3), Qunyin_mmWave_flash&USB (R5.1)
AR_QSPI_D1: Qunyin_mmWave_mainIOs (U3.G2), Qunyin_mmWave_flash&USB (R6.1)
AR_QSPI_D2: Qunyin_mmWave_mainIOs (U3.J3), Qunyin_mmWave_flash&USB (R2.1 R7.1)
AR_QSPI_D3: Qunyin_mmWave_mainIOs (U3.K2), Qunyin_mmWave_flash&USB (R3.1 R8.1)
AR_RS232RX: Qunyin_mmWave_mainIOs (R34.2 U3.V16), Qunyin_mmWave_flash&USB (R14.1), Qunyin_mmWave_ESP32 (U5.37 U6.1)
AR_RS232TX: Qunyin_mmWave_mainIOs (R35.2 U3.U16), Qunyin_mmWave_flash&USB (R13.2), Qunyin_mmWave_ESP32 (U5.36 U6.2)